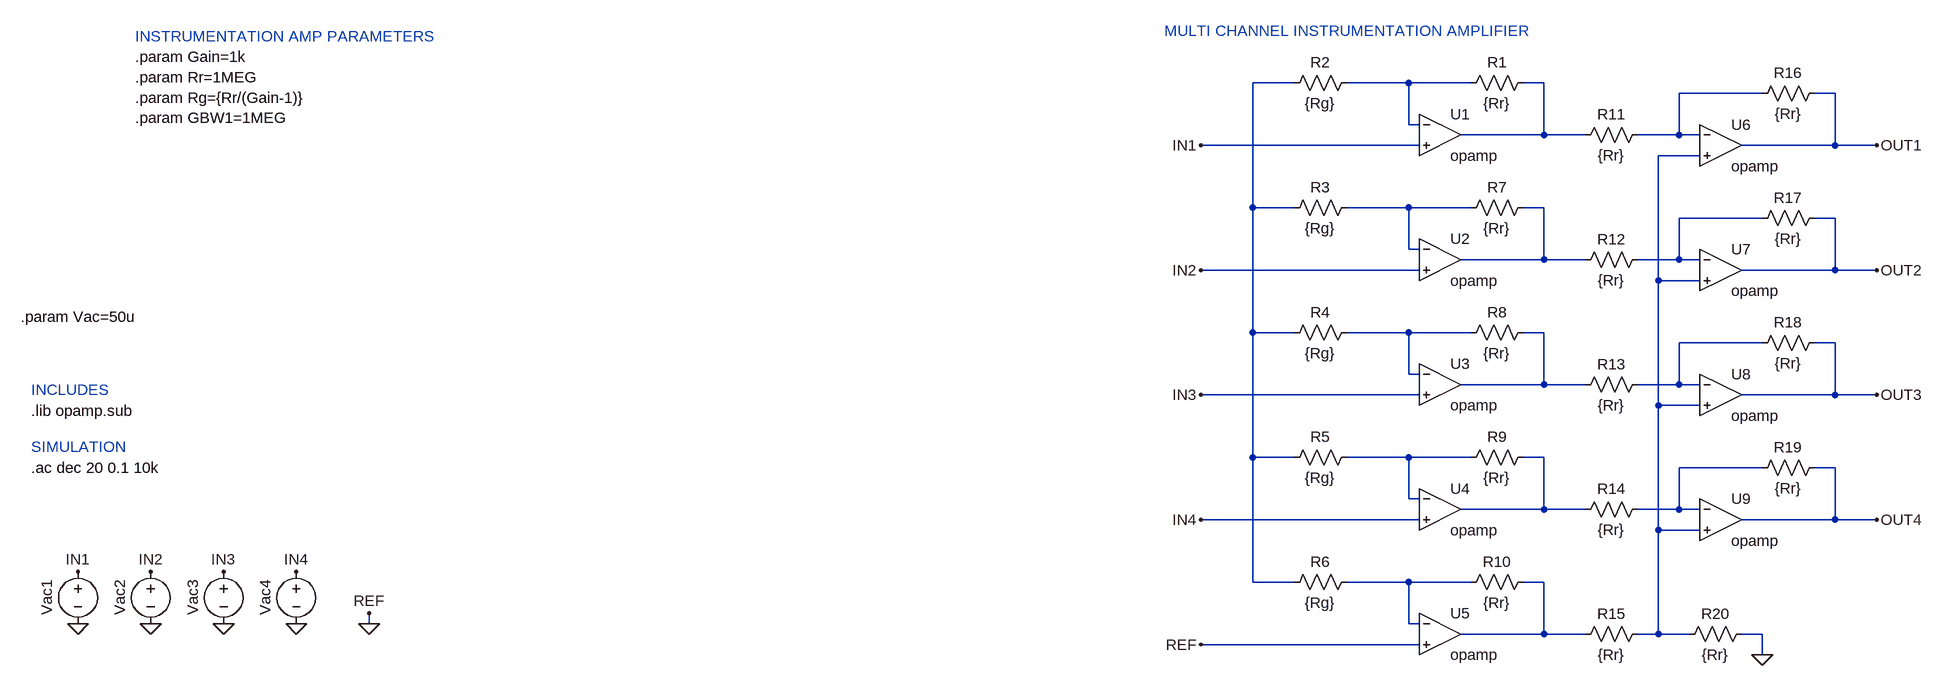
[diagram p0: schematic intrumentation-amp.asc]
intrumentation-amp.asc, the LTspice schematic file:
Version 4
SHEET 1 2688 804
WIRE 1712 -224 1648 -224
WIRE 1888 -224 1792 -224
WIRE 1984 -224 1888 -224
WIRE 2096 -224 2064 -224
WIRE 2432 -208 2304 -208
WIRE 2544 -208 2512 -208
WIRE 1888 -160 1888 -224
WIRE 1904 -160 1888 -160
WIRE 2096 -144 2096 -224
WIRE 2096 -144 1968 -144
WIRE 2160 -144 2096 -144
WIRE 2304 -144 2304 -208
WIRE 2304 -144 2240 -144
WIRE 2336 -144 2304 -144
WIRE 1904 -128 1568 -128
WIRE 2544 -128 2544 -208
WIRE 2544 -128 2400 -128
WIRE 2608 -128 2544 -128
WIRE 2336 -112 2272 -112
WIRE 1648 -32 1648 -224
WIRE 1712 -32 1648 -32
WIRE 1888 -32 1792 -32
WIRE 1984 -32 1888 -32
WIRE 2096 -32 2064 -32
WIRE 2432 -16 2304 -16
WIRE 2544 -16 2512 -16
WIRE 1888 32 1888 -32
WIRE 1904 32 1888 32
WIRE 2096 48 2096 -32
WIRE 2096 48 1968 48
WIRE 2160 48 2096 48
WIRE 2304 48 2304 -16
WIRE 2304 48 2240 48
WIRE 2336 48 2304 48
WIRE 1904 64 1568 64
WIRE 2544 64 2544 -16
WIRE 2544 64 2400 64
WIRE 2608 64 2544 64
WIRE 2272 80 2272 -112
WIRE 2336 80 2272 80
WIRE 1648 160 1648 -32
WIRE 1712 160 1648 160
WIRE 1888 160 1792 160
WIRE 1984 160 1888 160
WIRE 2096 160 2064 160
WIRE 2432 176 2304 176
WIRE 2544 176 2512 176
WIRE 1888 224 1888 160
WIRE 1904 224 1888 224
WIRE 2096 240 2096 160
WIRE 2096 240 1968 240
WIRE 2160 240 2096 240
WIRE 2304 240 2304 176
WIRE 2304 240 2240 240
WIRE 2336 240 2304 240
WIRE 1904 256 1568 256
WIRE 2544 256 2544 176
WIRE 2544 256 2400 256
WIRE 2608 256 2544 256
WIRE 2272 272 2272 80
WIRE 2336 272 2272 272
WIRE 1648 352 1648 160
WIRE 1712 352 1648 352
WIRE 1888 352 1792 352
WIRE 1984 352 1888 352
WIRE 2096 352 2064 352
WIRE 2432 368 2304 368
WIRE 2544 368 2512 368
WIRE 1888 416 1888 352
WIRE 1904 416 1888 416
WIRE 2096 432 2096 352
WIRE 2096 432 1968 432
WIRE 2160 432 2096 432
WIRE 2304 432 2304 368
WIRE 2304 432 2240 432
WIRE 2336 432 2304 432
WIRE 1904 448 1568 448
WIRE 2544 448 2544 368
WIRE 2544 448 2400 448
WIRE 2608 448 2544 448
WIRE 2272 464 2272 272
WIRE 2336 464 2272 464
WIRE 1648 544 1648 352
WIRE 1712 544 1648 544
WIRE 1888 544 1792 544
WIRE 1984 544 1888 544
WIRE 2096 544 2064 544
WIRE 288 608 288 592
WIRE 1888 608 1888 544
WIRE 1904 608 1888 608
WIRE 2096 624 2096 544
WIRE 2096 624 1968 624
WIRE 2160 624 2096 624
WIRE 2272 624 2272 464
WIRE 2272 624 2240 624
WIRE 2320 624 2272 624
WIRE 2432 624 2400 624
WIRE 1904 640 1568 640
WIRE 2432 656 2432 624
FLAG 2432 656 0
FLAG 1568 -128 IN1
FLAG 1568 64 IN2
FLAG 1568 256 IN3
FLAG 1568 448 IN4
FLAG 1568 640 REF
FLAG 2608 -128 OUT1
FLAG 2608 64 OUT2
FLAG 2608 256 OUT3
FLAG 2608 448 OUT4
FLAG -160 528 IN1
FLAG -48 528 IN2
FLAG 64 528 IN3
FLAG 176 528 IN4
FLAG 288 592 REF
FLAG -160 608 0
FLAG -48 608 0
FLAG 64 608 0
FLAG 176 608 0
FLAG 288 608 0
SYMBOL res 2080 -240 R90
WINDOW 0 0 56 VBottom 2
WINDOW 3 32 56 VTop 2
SYMATTR InstName R1
SYMATTR Value {Rr}
SYMBOL res 1808 -240 R90
WINDOW 0 0 56 VBottom 2
WINDOW 3 32 56 VTop 2
SYMATTR InstName R2
SYMATTR Value {Rg}
SYMBOL res 1808 -48 R90
WINDOW 0 0 56 VBottom 2
WINDOW 3 32 56 VTop 2
SYMATTR InstName R3
SYMATTR Value {Rg}
SYMBOL res 1808 144 R90
WINDOW 0 0 56 VBottom 2
WINDOW 3 32 56 VTop 2
SYMATTR InstName R4
SYMATTR Value {Rg}
SYMBOL res 1808 336 R90
WINDOW 0 0 56 VBottom 2
WINDOW 3 32 56 VTop 2
SYMATTR InstName R5
SYMATTR Value {Rg}
SYMBOL res 1808 528 R90
WINDOW 0 0 56 VBottom 2
WINDOW 3 32 56 VTop 2
SYMATTR InstName R6
SYMATTR Value {Rg}
SYMBOL res 2080 -48 R90
WINDOW 0 0 56 VBottom 2
WINDOW 3 32 56 VTop 2
SYMATTR InstName R7
SYMATTR Value {Rr}
SYMBOL res 2080 144 R90
WINDOW 0 0 56 VBottom 2
WINDOW 3 32 56 VTop 2
SYMATTR InstName R8
SYMATTR Value {Rr}
SYMBOL res 2080 336 R90
WINDOW 0 0 56 VBottom 2
WINDOW 3 32 56 VTop 2
SYMATTR InstName R9
SYMATTR Value {Rr}
SYMBOL res 2080 528 R90
WINDOW 0 0 56 VBottom 2
WINDOW 3 32 56 VTop 2
SYMATTR InstName R10
SYMATTR Value {Rr}
SYMBOL res 2256 -160 R90
WINDOW 0 0 56 VBottom 2
WINDOW 3 32 56 VTop 2
SYMATTR InstName R11
SYMATTR Value {Rr}
SYMBOL res 2256 32 R90
WINDOW 0 0 56 VBottom 2
WINDOW 3 32 56 VTop 2
SYMATTR InstName R12
SYMATTR Value {Rr}
SYMBOL res 2256 224 R90
WINDOW 0 0 56 VBottom 2
WINDOW 3 32 56 VTop 2
SYMATTR InstName R13
SYMATTR Value {Rr}
SYMBOL res 2256 416 R90
WINDOW 0 0 56 VBottom 2
WINDOW 3 32 56 VTop 2
SYMATTR InstName R14
SYMATTR Value {Rr}
SYMBOL res 2256 608 R90
WINDOW 0 0 56 VBottom 2
WINDOW 3 32 56 VTop 2
SYMATTR InstName R15
SYMATTR Value {Rr}
SYMBOL res 2528 -224 R90
WINDOW 0 0 56 VBottom 2
WINDOW 3 32 56 VTop 2
SYMATTR InstName R16
SYMATTR Value {Rr}
SYMBOL res 2528 -32 R90
WINDOW 0 0 56 VBottom 2
WINDOW 3 32 56 VTop 2
SYMATTR InstName R17
SYMATTR Value {Rr}
SYMBOL res 2528 160 R90
WINDOW 0 0 56 VBottom 2
WINDOW 3 32 56 VTop 2
SYMATTR InstName R18
SYMATTR Value {Rr}
SYMBOL res 2528 352 R90
WINDOW 0 0 56 VBottom 2
WINDOW 3 32 56 VTop 2
SYMATTR InstName R19
SYMATTR Value {Rr}
SYMBOL res 2416 608 R90
WINDOW 0 0 56 VBottom 2
WINDOW 3 32 56 VTop 2
SYMATTR InstName R20
SYMATTR Value {Rr}
SYMBOL Opamps\\opamp 1936 -208 R0
SYMATTR InstName U1
SYMATTR SpiceLine2 GBW={GBW1}
SYMBOL Opamps\\opamp 1936 -16 R0
SYMATTR InstName U2
SYMATTR SpiceLine2 GBW={GBW1}
SYMBOL Opamps\\opamp 1936 176 R0
SYMATTR InstName U3
SYMATTR SpiceLine2 GBW={GBW1}
SYMBOL Opamps\\opamp 1936 368 R0
SYMATTR InstName U4
SYMATTR SpiceLine2 GBW={GBW1}
SYMBOL Opamps\\opamp 1936 560 R0
SYMATTR InstName U5
SYMATTR SpiceLine2 GBW={GBW1}
SYMBOL Opamps\\opamp 2368 -192 R0
SYMATTR InstName U6
SYMATTR SpiceLine2 GBW={GBW1}
SYMBOL Opamps\\opamp 2368 0 R0
SYMATTR InstName U7
SYMATTR SpiceLine2 GBW={GBW1}
SYMBOL Opamps\\opamp 2368 192 R0
SYMATTR InstName U8
SYMATTR SpiceLine2 GBW={GBW1}
SYMBOL Opamps\\opamp 2368 384 R0
SYMATTR InstName U9
SYMATTR SpiceLine2 GBW={GBW1}
SYMBOL voltage -160 512 R0
WINDOW 0 -32 56 VBottom 2
WINDOW 3 32 56 Left 2
WINDOW 39 0 0 Left 0
SYMATTR InstName Vac1
SYMATTR Value ""
SYMATTR Value2 AC 1
SYMBOL voltage -48 512 R0
WINDOW 0 -32 56 VBottom 2
WINDOW 3 32 56 Left 2
WINDOW 39 0 0 Left 0
SYMATTR InstName Vac2
SYMATTR Value ""
SYMATTR Value2 AC 1
SYMBOL voltage 64 512 R0
WINDOW 0 -32 56 VBottom 2
WINDOW 3 32 56 Left 2
WINDOW 39 0 0 Left 0
SYMATTR InstName Vac3
SYMATTR Value ""
SYMATTR Value2 AC 1
SYMBOL voltage 176 512 R0
WINDOW 0 -32 56 VBottom 2
WINDOW 3 32 56 Left 2
WINDOW 39 0 0 Left 0
SYMATTR InstName Vac4
SYMATTR Value ""
SYMATTR Value2 AC 1
TEXT -72 -296 Left 2 ;INSTRUMENTATION AMP PARAMETERS
TEXT -72 -264 Left 2 !.param Gain=1k\n.param Rr=1MEG\n.param Rg={Rr/(Gain-1)}\n.param GBW1=1MEG
TEXT 1512 -304 Left 2 ;MULTI CHANNEL INSTRUMENTATION AMPLIFIER
TEXT -232 336 Left 2 ;SIMULATION
TEXT -232 368 Left 2 !.ac dec 20 0.1 10k
TEXT -232 280 Left 2 !.lib opamp.sub
TEXT -232 248 Left 2 ;INCLUDES
TEXT -248 136 Left 2 !.param Vac=50u

The netlist it stands for:
* intrumentation-amp.asc
R1 N003 N002 {Rr}
R2 N002 N001 {Rg}
R3 N006 N001 {Rg}
R4 N009 N001 {Rg}
R5 N012 N001 {Rg}
R6 N015 N001 {Rg}
R7 N007 N006 {Rr}
R8 N010 N009 {Rr}
R9 N013 N012 {Rr}
R10 N016 N015 {Rr}
R11 N004 N003 {Rr}
R12 N008 N007 {Rr}
R13 N011 N010 {Rr}
R14 N014 N013 {Rr}
R15 N005 N016 {Rr}
R16 OUT1 N004 {Rr}
R17 OUT2 N008 {Rr}
R18 OUT3 N011 {Rr}
R19 OUT4 N014 {Rr}
R20 0 N005 {Rr}
XU1 N002 IN1 N003 opamp Aol=100K GBW={GBW1}  ; pins invin noninvin out
XU2 N006 IN2 N007 opamp Aol=100K GBW={GBW1}  ; pins invin noninvin out
XU3 N009 IN3 N010 opamp Aol=100K GBW={GBW1}  ; pins invin noninvin out
XU4 N012 IN4 N013 opamp Aol=100K GBW={GBW1}  ; pins invin noninvin out
XU5 N015 0 N016 opamp Aol=100K GBW={GBW1}  ; pins invin noninvin out
XU6 N004 N005 OUT1 opamp Aol=100K GBW={GBW1}  ; pins invin noninvin out
XU7 N008 N005 OUT2 opamp Aol=100K GBW={GBW1}  ; pins invin noninvin out
XU8 N011 N005 OUT3 opamp Aol=100K GBW={GBW1}  ; pins invin noninvin out
XU9 N014 N005 OUT4 opamp Aol=100K GBW={GBW1}  ; pins invin noninvin out
Vac1 IN1 0 AC 1
Vac2 IN2 0 AC 1
Vac3 IN3 0 AC 1
Vac4 IN4 0 AC 1
* INSTRUMENTATION AMP PARAMETERS
.param Gain=1k
.param Rr=1MEG
.param Rg={Rr/(Gain-1)}
.param GBW1=1MEG
* MULTI CHANNEL INSTRUMENTATION AMPLIFIER
* SIMULATION
.ac dec 20 0.1 10k
.lib opamp.sub
* INCLUDES
.param Vac=50u
.backanno
.end